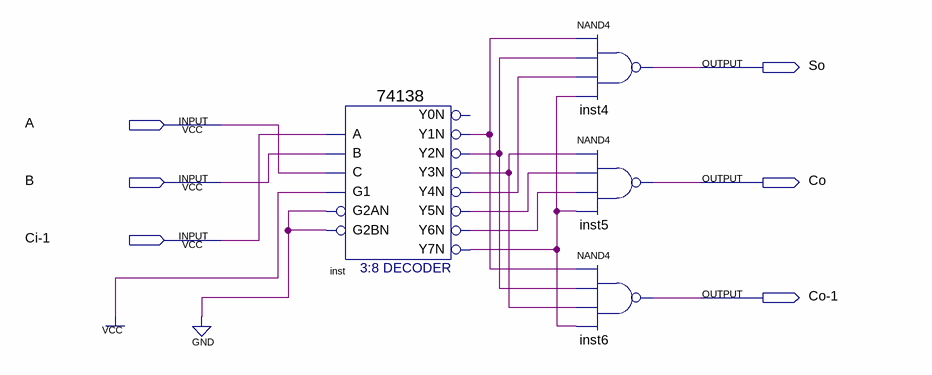
[diagram p0: schematic sheet]
// Quartus schematic Block1.bdf as structural Verilog: 4 symbols, 6 pins
module Block1 (
  input  A,
  input  B,
  input  \Ci-1 ,
  output So,
  output Co,
  output \Co-1 
);

  wire inst_y1n, inst_y2n, inst_y3n, inst_y4n, inst_y5n, inst_y6n, inst_y7n;

  \74138  inst (
    .A(\Ci-1 ), .B(B), .G1(1'b1), .C(A), .G2AN(1'b0), .G2BN(1'b0), .Y1N(inst_y1n), .Y2N(inst_y2n),
    .Y3N(inst_y3n), .Y4N(inst_y4n), .Y5N(inst_y5n), .Y6N(inst_y6n), .Y7N(inst_y7n));  // open: Y0N
  nand inst4 (So, inst_y1n, inst_y2n, inst_y4n, inst_y7n);
  nand inst5 (Co, inst_y3n, inst_y5n, inst_y6n, inst_y7n);
  nand inst6 (\Co-1 , inst_y1n, inst_y2n, inst_y3n, inst_y7n);
endmodule
